# Altium schematic sheet Table_Of_Contents.SchDoc: Table of Contents
size 279 x 215 mm; CompanyName: Flat Earth Inc.; DrawnBy: Connor Dack; Engineer: Connor Dack; Address1: 985 Technology Blvd; Address2: Suite 102; Address3: Bozeman, MT, 59718; DocumentNumber: 2; Revision: 0.0; SheetNumber: 2; SheetTotal: 8
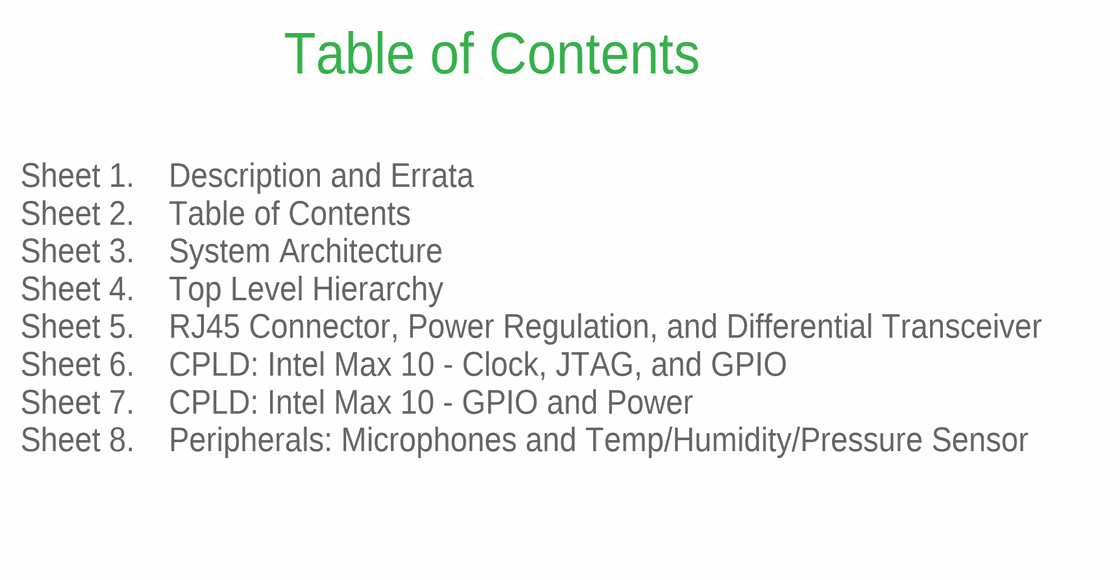
[diagram p0: Table_Of_Contents.SchDoc]

## Notes on the sheet
- Table of Contents
- Sheet 1.    Description and Errata
  Sheet 2.    Table of Contents
  Sheet 3.    System Architecture
  Sheet 4.    Top Level Hierarchy
  Sheet 5.    RJ45 Connector, Power Regulation, and Differential Transceiver
  Sheet 6.    CPLD: Intel Max 10 - Clock, JTAG, and GPIO
  Sheet 7.    CPLD: Intel Max 10 - GPIO and Power
  Sheet 8.    Peripherals: Microphones and Temp/Humidity/Pressure Sensor
- Title:
- Sheet:
- of
- Size:
- 11 x 8.5 Inches
- Rev:
- Date:
- Engineer:
- Time:
- File:
- Copyright 2020 Audio Logic Inc
  THE HARDWARE IS PROVIDED "AS IS", WITHOUT WARRANTY OF ANY KIND, EXPRESS OR IMPLIED, INCLUDING BUT NOT LIMITED TO THE WARRANTIES OF MERCHANTABILITY, FITNESS FOR A PARTICULAR PURPOSE AND NONINFRINGEMENT. IN NO EVENT SHALL THE AUTHORS OR COPYRIGHT HOLDERS BE LIABLE FOR ANY CLAIM, DAMAGES OR OTHER LIABILITY, WHETHER IN AN ACTION OF CONTRACT, TORT OR OTHERWISE, ARISING FROM, OUT OF OR IN CONNECTION WITH THE HARDWARE OR THE USE OR OTHER DEALINGS IN THE HARDWARE.